# Altium schematic sheet Sheet1.SchDoc
size A4
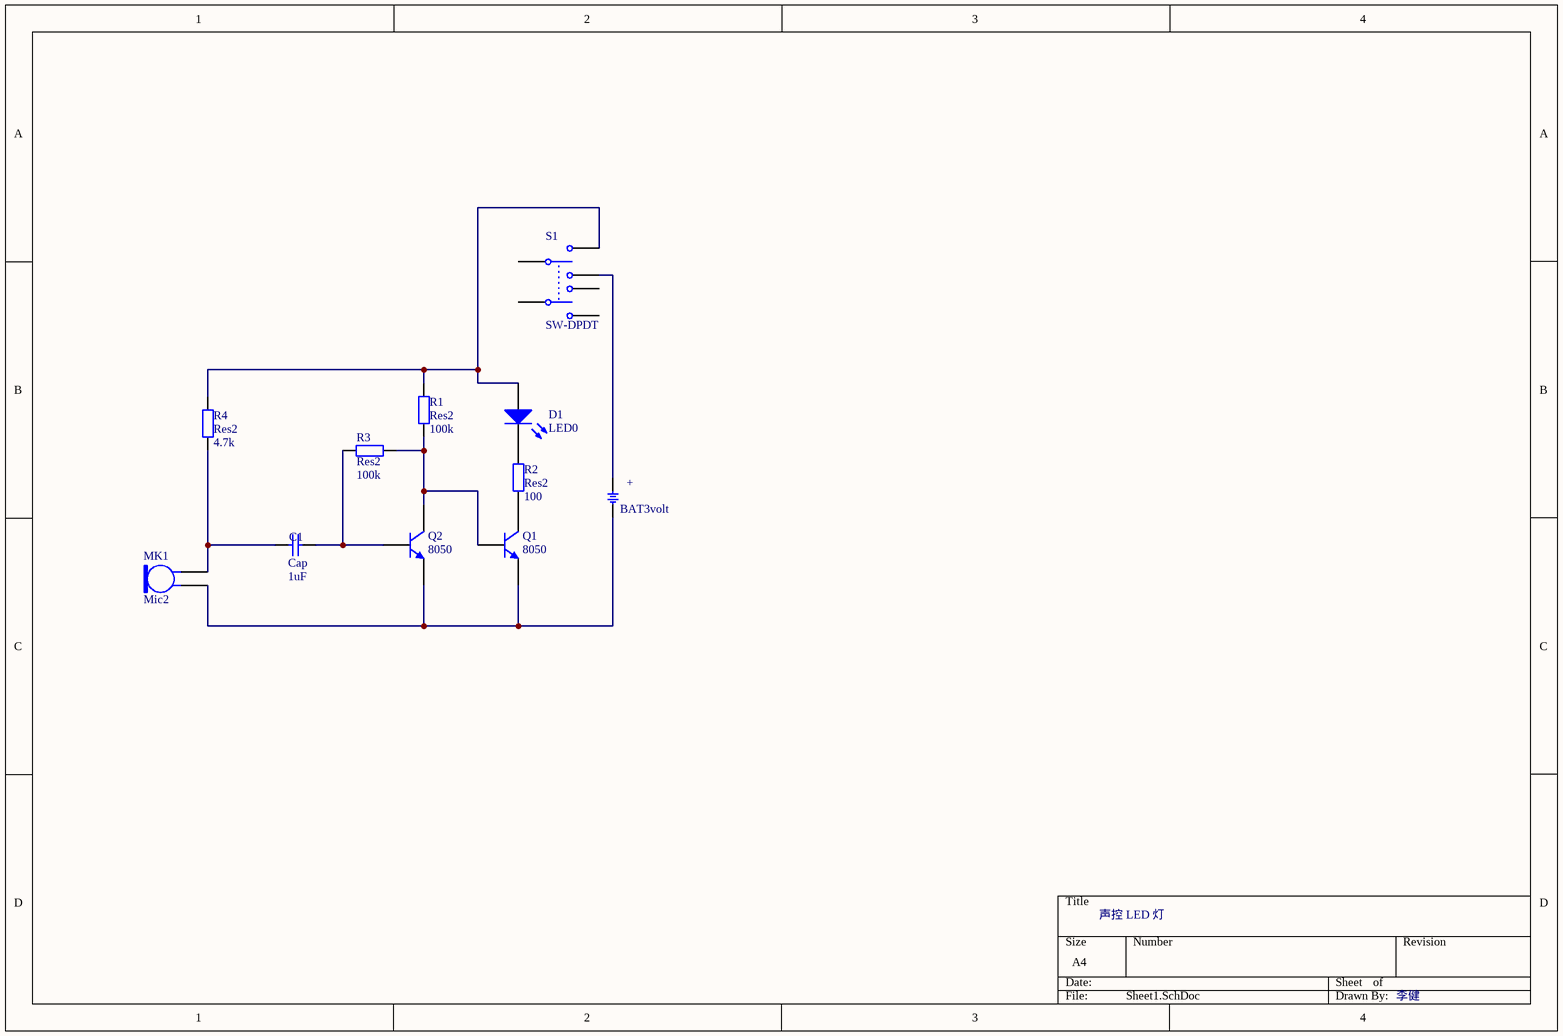
[diagram p0: Sheet1.SchDoc]

## Parts
BT1  BAT3volt  [BTH2032]
C1  Cap  value 1uF  [RAD-0.2]
D1  LED0  [LED-0]
MK1  Mic2  [PIN2]
Q1  8050  [TO-92]
Q2  8050  [TO-92]
R1  Res2  value 100k  [AXIAL-0.4]
R2  Res2  value 100  [AXIAL-0.4]
R3  Res2  value 100k  [AXIAL-0.4]
R4  Res2  value 4.7k  [AXIAL-0.4]
S1  SW-DPDT  [DPDT-6]

## Nets
NetBT1_1: BT1.1 S1.3
NetBT1_2: BT1.2 MK1.1 Q1.1(E) Q2.1(E)
NetC1_1: C1.1 MK1.2 R4.1
NetC1_2: C1.2 Q2.2(B) R3.2
NetD1_1: D1.1(A) R1.2 R4.2 S1.2
NetD1_2: D1.2(K) R2.2
NetQ1_2: Q1.2(B) Q2.3(C) R1.1 R3.1
NetQ1_3: Q1.3(C) R2.1

Not connected (* = marked no-connect by the designer): S1 1 4 5 6

## Notes on the sheet
- (near BT1) +
- 声控 LED 灯
- 李健

## Library data of the parts
BT1 = BATH_CR2032: BATTERY HOLDER, CR2032; VALUE: BAT3volt; MANF_P#: -; .: http://www.chila.ir
C1 = Cap: Capacitor; Published: 8-Jun-2000; LatestRevisionDate: 17-Jul-2002; LatestRevisionNote: Re-released for DXP Platform.; PackageReference: RAD-0.3; Publisher: Altium Limited; PackageDescription: Radial Cap, Thru-Hole; 2 Leads; 0.3 in Pin Spacing
D1 = LED0: Typical INFRARED GaAs LED; Published: 8-Jun-2000; LatestRevisionDate: 08-Jul-2005; LatestRevisionNote: Mech Layer 1 removed.; PackageReference: LED-0; Publisher: Altium Limited; PackageDescription: LED; 2 Leads
MK1 = Mic2: Microphone; Published: 24-Mar-1999; LatestRevisionDate: 17-Jul-2002; LatestRevisionNote: Re-released for DXP Platform.; PackageReference: PIN2; Publisher: Altium Limited
Q1 Q2 = 2N3904: NPN General Purpose Amplifier; Published: 8-Jun-2000; LatestRevisionDate: 15-Jan-2003; LatestRevisionNote: PCB Footprint 'BCY-W3/D4.7' replaced; DatasheetVersion: 1997; PackageVersion: Sep-1998; PackageReference: TO-92A; Publisher: Altium Limited; PackageDescription: TO, Flat Index; 3 In-Line, Axial Leads; Body Dia. 4.5mm; Leads 0.51 x 0.48 mm (max); ComponentLink1Description: Manufacturer Link; ComponentLink1URL: http://www.fairchildsemi.com/; ComponentLink2Description: Datasheet; ComponentLink2URL: http://www.fairchildsemi.com/ds/2N%2F2N3904.pdf
R1-R4 = Res2: Resistor; Published: 8-Jun-2000; LatestRevisionDate: 17-Jul-2002; LatestRevisionNote: Re-released for DXP Platform.; PackageReference: AXIAL-0.4; Publisher: Altium Limited; PackageDescription: Axial Device, Thru-Hole; 2 Leads; 0.4 in Pin Spacing
S1 = SW-DPDT: Double-Pole, Double-Throw Switch; Published: 24-Mar-1999; LatestRevisionDate: 17-Jul-2002; LatestRevisionNote: Re-released for DXP Platform.; PackageReference: DPDT-6; Publisher: Altium Limited; PackageDescription: Switch; 6 Leads